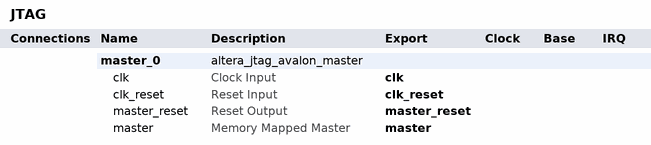
[diagram p0: system contents]
# Platform Designer (Qsys) system JTAG, Arria 10 10AX115N2F45E1SG
# Parameters at their usual value, and those the tool derives, are not listed.
package require -exact qsys 17.0
create_system JTAG
set_project_property DEVICE_FAMILY {Arria 10}
set_project_property DEVICE 10AX115N2F45E1SG

add_instance master_0 altera_jtag_avalon_master 17.0
set_instance_property master_0 AUTO_EXPORT true

# exported interfaces
add_interface clk clock sink
set_interface_property clk EXPORT_OF master_0.clk
add_interface clk_reset reset sink
set_interface_property clk_reset EXPORT_OF master_0.clk_reset
add_interface master avalon master
set_interface_property master EXPORT_OF master_0.master
add_interface master_reset reset source
set_interface_property master_reset EXPORT_OF master_0.master_reset

set_interconnect_requirement {$system} qsys_mm.clockCrossingAdapter HANDSHAKE
set_interconnect_requirement {$system} qsys_mm.enableEccProtection FALSE
set_interconnect_requirement {$system} qsys_mm.insertDefaultSlave FALSE
set_interconnect_requirement {$system} qsys_mm.maxAdditionalLatency 1

save_system JTAG.qsys
